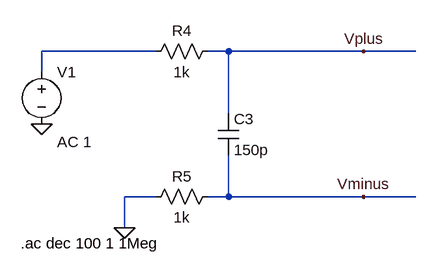
[diagram p0: schematic single-ended_to_differential.asc]
single-ended_to_differential.asc, the LTspice schematic file:
Version 4
SHEET 1 1080 680
WIRE 416 -16 240 -16
WIRE 528 -16 496 -16
WIRE 736 -16 528 -16
WIRE 816 -16 736 -16
WIRE 240 16 240 -16
WIRE 528 80 528 -16
WIRE 416 208 368 208
WIRE 528 208 528 144
WIRE 528 208 496 208
WIRE 736 208 528 208
WIRE 816 208 736 208
WIRE 368 256 368 208
FLAG 368 256 0
FLAG 240 96 0
FLAG 736 208 Vminus
FLAG 736 -16 Vplus
SYMBOL res 512 -32 R90
WINDOW 0 0 56 VBottom 2
WINDOW 3 32 56 VTop 2
SYMATTR InstName R4
SYMATTR Value 1k
SYMBOL cap 512 80 R0
SYMATTR InstName C3
SYMATTR Value 150p
SYMBOL res 512 192 R90
WINDOW 0 0 56 VBottom 2
WINDOW 3 32 56 VTop 2
SYMATTR InstName R5
SYMATTR Value 1k
SYMBOL voltage 240 0 R0
WINDOW 123 24 124 Left 2
WINDOW 39 0 0 Left 0
SYMATTR Value2 AC 1
SYMATTR InstName V1
SYMATTR Value ""
TEXT 208 280 Left 2 !.ac dec 100 1 1Meg

The netlist it stands for:
* single-ended_to_differential.asc
R4 Vplus N001 1k
C3 Vplus Vminus 150p
R5 Vminus 0 1k
V1 N001 0 AC 1
.ac dec 100 1 1Meg
.backanno
.end